# EAGLE design open-bldc (EAGLE 6.2)
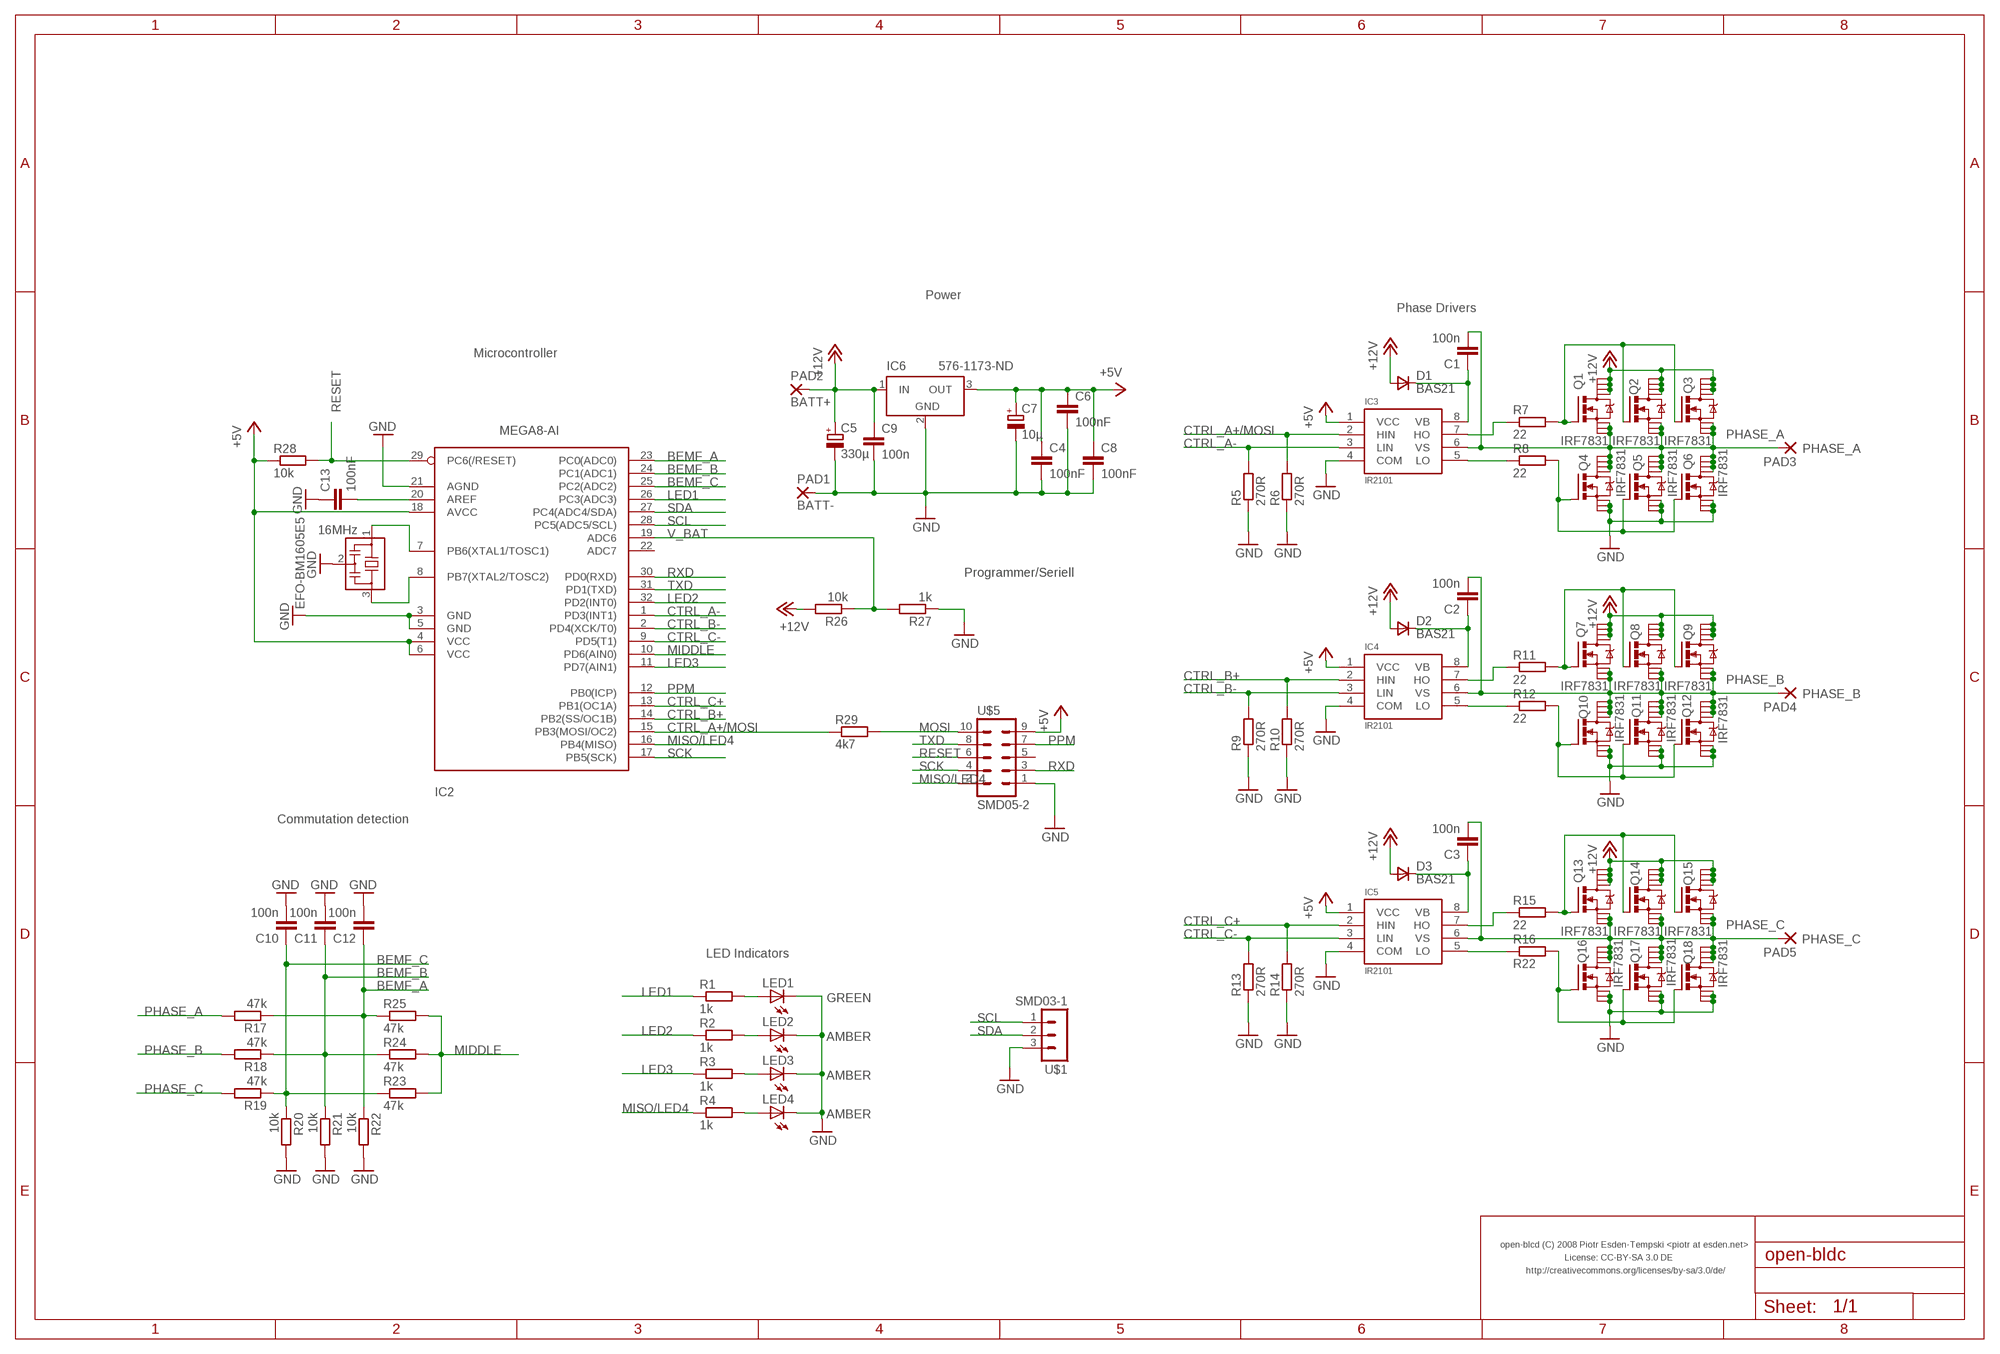
[diagram p0: schematic, sheet 1]

## Parts
C1  100n  C-EUC0603  [C0603]
C2  100n  C-EUC0603  [C0603]
C3  100n  C-EUC0603  [C0603]
C4  100nF  C-EUC0603  [C0603]
C5  330µ  CPOL-EUE3.5-8  [E3,5-8]
C6  100nF  C-EUC0603  [C0603]
C7  10µ  CPOL-EUD/7343-31R  [D/7343-31R]
C8  100nF  C-EUC0603  [C0603]
C9  100n  C-EUC0603  [C0603]
C10  100n  C-EUC0603  [C0603]
C11  100n  C-EUC0603  [C0603]
C12  100n  C-EUC0603  [C0603]
C13  100nF  C-EUC0603  [C0603]
D1  BAS21  VAR2SOT23  [SOT-23]
D2  BAS21  VAR2SOT23  [SOT-23]
D3  BAS21  VAR2SOT23  [SOT-23]
EFO-BM1605E5  16MHz  EFOBM  [EFOBM]
IC2  MEGA8-AI  [TQFP32-08]
IC3  IR2101  [SO-8]
IC4  IR2101  [SO-8]
IC5  IR2101  [SO-8]
IC6  576-1173-ND  LT1129CST5  [SOT223]
LED1  GREEN  LEDCHIP-LED0603  [CHIP-LED0603]
LED2  AMBER  LEDCHIP-LED0603  [CHIP-LED0603]
LED3  AMBER  LEDCHIP-LED0603  [CHIP-LED0603]
LED4  AMBER  LEDCHIP-LED0603  [CHIP-LED0603]
PAD1  BATT-  SMD5  [SMD2,54-5,08]
PAD2  BATT+  SMD5  [SMD2,54-5,08]
PAD3  PHASE_A  SMD5  [SMD2,54-5,08]
PAD4  PHASE_B  SMD5  [SMD2,54-5,08]
PAD5  PHASE_C  SMD5  [SMD2,54-5,08]
Q1  IRF7831  N-MOSFET-SO8S  [SO-08]
Q2  IRF7831  N-MOSFET-SO8S  [SO-08]
Q3  IRF7831  N-MOSFET-SO8S  [SO-08]
Q4  IRF7831  N-MOSFET-SO8S  [SO-08]
Q5  IRF7831  N-MOSFET-SO8S  [SO-08]
Q6  IRF7831  N-MOSFET-SO8S  [SO-08]
Q7  IRF7831  N-MOSFET-SO8S  [SO-08]
Q8  IRF7831  N-MOSFET-SO8S  [SO-08]
Q9  IRF7831  N-MOSFET-SO8S  [SO-08]
Q10  IRF7831  N-MOSFET-SO8S  [SO-08]
Q11  IRF7831  N-MOSFET-SO8S  [SO-08]
Q12  IRF7831  N-MOSFET-SO8S  [SO-08]
Q13  IRF7831  N-MOSFET-SO8S  [SO-08]
Q14  IRF7831  N-MOSFET-SO8S  [SO-08]
Q15  IRF7831  N-MOSFET-SO8S  [SO-08]
Q16  IRF7831  N-MOSFET-SO8S  [SO-08]
Q17  IRF7831  N-MOSFET-SO8S  [SO-08]
Q18  IRF7831  N-MOSFET-SO8S  [SO-08]
R1  1k  R-EU_R0603  [R0603]
R2  1k  R-EU_R0603  [R0603]
R3  1k  R-EU_R0603  [R0603]
R4  1k  R-EU_R0603  [R0603]
R5  270R  R-EU_R0603  [R0603]
R6  270R  R-EU_R0603  [R0603]
R7  22  R-EU_R0603  [R0603]
R8  22  R-EU_R0603  [R0603]
R9  270R  R-EU_R0603  [R0603]
R10  270R  R-EU_R0603  [R0603]
R11  22  R-EU_R0603  [R0603]
R12  22  R-EU_R0603  [R0603]
R13  270R  R-EU_R0603  [R0603]
R14  270R  R-EU_R0603  [R0603]
R15  22  R-EU_R0603  [R0603]
R16  R22  R-EU_R0603  [R0603]
R17  47k  R-EU_R0603  [R0603]
R18  47k  R-EU_R0603  [R0603]
R19  47k  R-EU_R0603  [R0603]
R20  10k  R-EU_R0603  [R0603]
R21  10k  R-EU_R0603  [R0603]
R22  10k  R-EU_R0603  [R0603]
R23  47k  R-EU_R0603  [R0603]
R24  47k  R-EU_R0603  [R0603]
R25  47k  R-EU_R0603  [R0603]
R26  10k  R-EU_R0603  [R0603]
R27  1k  R-EU_R0603  [R0603]
R28  10k  R-EU_R0603  [R0603]
R29  4k7  R-EU_R0603  [R0603]
U$1  SMD03-1  [SMD03-1]
U$5  SMD05-2  [SMD05-2]

## Nets
+5V: C4.1 C6.1 C7.+ C8.1 IC2.4(VCC) IC2.6(VCC) IC2.18(AVCC) IC3.1(VCC) IC4.1(VCC) IC5.1(VCC) IC6.3(OUT) R28.1 U$5.9
+12V: C5.+ C9.1 D1.3(A) D2.3(A) D3.3(A) IC6.1(IN) PAD2.1(P) Q1.5(D) Q1.6(D) Q1.7(D) Q1.8(D) Q2.5(D) Q2.6(D) Q2.7(D) Q2.8(D) Q3.5(D) Q3.6(D) Q3.7(D) Q3.8(D) Q7.5(D) Q7.6(D) Q7.7(D) Q7.8(D) Q8.5(D) Q8.6(D) Q8.7(D) Q8.8(D) Q9.5(D) Q9.6(D) Q9.7(D) Q9.8(D) Q13.5(D) Q13.6(D) Q13.7(D) Q13.8(D) Q14.5(D) Q14.6(D) Q14.7(D) Q14.8(D) Q15.5(D) Q15.6(D) Q15.7(D) Q15.8(D) R26.2
BEMF_A: C12.1 IC2.23(PC0(ADC0)) R17.1 R22.1 R25.1
BEMF_B: C11.1 IC2.24(PC1(ADC1)) R18.1 R21.1 R24.1
BEMF_C: C10.1 IC2.25(PC2(ADC2)) R19.1 R20.1 R23.1
CTRL_A+/MOSI: IC2.15(PB3(MOSI/OC2)) IC3.2(HIN) R6.2 R29.1
CTRL_A-: IC2.1(PD3(INT1)) IC3.3(LIN) R5.2
CTRL_B+: IC2.14(PB2(SS/OC1B)) IC4.2(HIN) R10.2
CTRL_B-: IC2.2(PD4(XCK/T0)) IC4.3(LIN) R9.2
CTRL_C+: IC2.13(PB1(OC1A)) IC5.2(HIN) R14.2
CTRL_C-: IC2.9(PD5(T1)) IC5.3(LIN) R13.2
GND: C4.2 C5.- C6.2 C7.- C8.2 C9.2 C10.2 C11.2 C12.2 C13.1 EFO-BM1605E5.2 IC2.3(GND) IC2.5(GND) IC2.21(AGND) IC3.4(COM) IC4.4(COM) IC5.4(COM) IC6.2(GND) LED1.C LED2.C LED3.C LED4.C PAD1.1(P) Q4.1(S) Q4.2(S) Q4.3(S) Q5.1(S) Q5.2(S) Q5.3(S) Q6.1(S) Q6.2(S) Q6.3(S) Q10.1(S) Q10.2(S) Q10.3(S) Q11.1(S) Q11.2(S) Q11.3(S) Q12.1(S) Q12.2(S) Q12.3(S) Q16.1(S) Q16.2(S) Q16.3(S) Q17.1(S) Q17.2(S) Q17.3(S) Q18.1(S) Q18.2(S) Q18.3(S) R5.1 R6.1 R9.1 R10.1 R13.1 R14.1 R20.2 R21.2 R22.2 R27.1 U$1.3 U$5.1
LED1: IC2.26(PC3(ADC3)) R1.1
LED2: IC2.32(PD2(INT0)) R2.1
LED3: IC2.11(PD7(AIN1)) R3.1
MIDDLE: IC2.10(PD6(AIN0)) R23.2 R24.2 R25.2
MISO/LED4: IC2.16(PB4(MISO)) R4.1 U$5.2
MOSI: R29.2 U$5.10
N$1: IC4.7(HO) R11.1
N$2: IC3.7(HO) R7.1
N$3: LED1.A R1.2
N$4: LED2.A R2.2
N$5: LED3.A R3.2
N$6: C13.2 IC2.20(AREF)
N$7: IC3.5(LO) R8.1
N$8: EFO-BM1605E5.1 IC2.7(PB6(XTAL1/TOSC1))
N$9: EFO-BM1605E5.3 IC2.8(PB7(XTAL2/TOSC2))
N$10: LED4.A R4.2
N$11: Q1.4(G) Q2.4(G) Q3.4(G) R7.2
N$12: C1.1 D1.1(C) IC3.8(VB)
N$13: IC4.5(LO) R12.1
N$14: Q7.4(G) Q8.4(G) Q9.4(G) R11.2
N$15: Q4.4(G) Q5.4(G) Q6.4(G) R8.2
N$16: C2.1 D2.1(C) IC4.8(VB)
N$17: Q10.4(G) Q11.4(G) Q12.4(G) R12.2
N$18: IC5.7(HO) R15.1
N$19: IC5.5(LO) R16.1
N$20: Q13.4(G) Q14.4(G) Q15.4(G) R15.2
N$21: C3.1 D3.1(C) IC5.8(VB)
N$22: Q16.4(G) Q17.4(G) Q18.4(G) R16.2
PHASE_A: C1.2 IC3.6(VS) PAD3.1(P) Q1.1(S) Q1.2(S) Q1.3(S) Q2.1(S) Q2.2(S) Q2.3(S) Q3.1(S) Q3.2(S) Q3.3(S) Q4.5(D) Q4.6(D) Q4.7(D) Q4.8(D) Q5.5(D) Q5.6(D) Q5.7(D) Q5.8(D) Q6.5(D) Q6.6(D) Q6.7(D) Q6.8(D) R17.2
PHASE_B: C2.2 IC4.6(VS) PAD4.1(P) Q7.1(S) Q7.2(S) Q7.3(S) Q8.1(S) Q8.2(S) Q8.3(S) Q9.1(S) Q9.2(S) Q9.3(S) Q10.5(D) Q10.6(D) Q10.7(D) Q10.8(D) Q11.5(D) Q11.6(D) Q11.7(D) Q11.8(D) Q12.5(D) Q12.6(D) Q12.7(D) Q12.8(D) R18.2
PHASE_C: C3.2 IC5.6(VS) PAD5.1(P) Q13.1(S) Q13.2(S) Q13.3(S) Q14.1(S) Q14.2(S) Q14.3(S) Q15.1(S) Q15.2(S) Q15.3(S) Q16.5(D) Q16.6(D) Q16.7(D) Q16.8(D) Q17.5(D) Q17.6(D) Q17.7(D) Q17.8(D) Q18.5(D) Q18.6(D) Q18.7(D) Q18.8(D) R19.2
PPM: IC2.12(PB0(ICP)) U$5.7
RESET: IC2.29(PC6(/RESET)) R28.2 U$5.6
RXD: IC2.30(PD0(RXD)) U$5.3
SCK: IC2.17(PB5(SCK)) U$5.4
SCL: IC2.28(PC5(ADC5/SCL)) U$1.1
SDA: IC2.27(PC4(ADC4/SDA)) U$1.2
TXD: IC2.31(PD1(TXD)) U$5.8
V_BAT: IC2.19(ADC6) R26.1 R27.2
Unconnected: IC2.22(ADC7) U$5.5

## Notes on the sheet
- Power
- Phase Drivers
- Microcontroller
- Programmer/Seriell
- Commutation detection
- LED Indicators
- open-blcd (C) 2008 Piotr Esden-Tempski <piotr at esden.net>
- License: CC-BY-SA 3.0 DE
- http://creativecommons.org/licenses/by-sa/3.0/de/

## Power pins joined to a net without a drawn wire
GND: IC6.4(GND)

## Library data of the parts
C1-C4 C6 C8-C13 = rcl:C-EU: CAPACITOR, European symbol
C5 C7 = rcl:CPOL-EU: POLARIZED CAPACITOR, European symbol
D1-D3 = zetex:VAR2SOT23: DIODE
EFO-BM1605E5 = open-bldc:EFOBM
IC2 = atmel:MEGA8: MICROCONTROLLER 8 Kbytes FLASH, 1 kbytes SRAM, 512 bytes EEPROM, USART, 6-channel 10 bit ADC, 2-channel 8 bit ADC Pin compatible with Atmega48, ATMega88, ATMega168 Source: avr.lbr
IC3-IC5 = open-bldc:IR2101
IC6 = linear-technology:LT1129CST5: VOLTAGE REGULATOR with shutdown
LED1-LED4 = led:LED: LED OSRAM: - CHIPLED LG R971, LG N971, LY N971, LG Q971, LY Q971, LO R971, LY R971 LH N974, LH R974 LS Q976, LO Q976, LY Q976 LO Q996 - Hyper CHIPLED LW Q18S LB Q993, LB Q99A, LB R99A - SideLED LS A670, LO A670, LY A670, LG A670, LP A670 LB A673, LV A673, LT A673, LW A673 LH A674 LY A675 LS A676, LA A676, LO A676, LY A676, LW A676 LS A679, LY A679, LG A679 - Hyper Micro SIDELED® LS Y876, LA Y876, LO Y876, LY Y876 LT Y87S - SmartLED LW L88C, LW L88S LB L89C, LB L89S, LG L890 LS L89K, LO L89K, LY L89K LS L896, LA L896, LO L896, LY L896 - TOPLED LS T670, LO T670, LY T670, LG T670, LP T670 LSG T670, LSP T670, LSY T670, LOP T670, LYG T670 LG T671, LOG T671, LSG T671 LB T673, LV T673, LT T673, LW T673 LH T674 LS T676, LA T676, LO T676, LY T676, LB T676, LH T676, LSB T676, LW T676 LB T67C, LV T67C, LT T67C, LS T67K, LO T67K, LY T67K, LW E67C LS E67B, LA E67B, LO E67B, LY E67B, LB E67C, LV E67C, LT E67C LW T67C LS T679, LY T679, LG T679 LS T770, LO T770, LY T770, LG T770, LP T770 LB T773, LV T773, LT T773, LW T773 LH T774 LS E675, LA E675, LY E675, LS T675 LS T776, LA T776, LO T776, LY T776, LB T776 LHGB T686 LT T68C, LB T68C - Hyper Mini TOPLED® LB M676 - Mini TOPLED Santana® LG M470 LS M47K, LO M47K, LY M47K Source: http://www.osram.convergy.de LUXEON: - LUMILED® LXK2-PW12-R00, LXK2-PW12-S00, LXK2-PW14-U00, LXK2-PW14-V00 LXK2-PM12-R00, LXK2-PM12-S00, LXK2-PM14-U00 LXK2-PE12-Q00, LXK2-PE12-R00, LXK2-PE12-S00, LXK2-PE14-T00, LXK2-PE14-U00 LXK2-PB12-K00, LXK2-PB12-L00, LXK2-PB12-M00, LXK2-PB14-N00, LXK2-PB14-P00, LXK2-PB14-Q00 LXK2-PR12-L00, LXK2-PR12-M00, LXK2-PR14-Q00, LXK2-PR14-R00 LXK2-PD12-Q00, LXK2-PD12-R00, LXK2-PD12-S00 LXK2-PH12-R00, LXK2-PH12-S00 LXK2-PL12-P00, LXK2-PL12-Q00, LXK2-PL12-R00 Source: www.luxeon.com KINGBRIGHT: KA-3528ASYC Source: www.kingbright.com
PAD1-PAD5 = wirepad:SMD5: SMD PAD
Q1-Q18 = my-transistor-power:N-MOSFET-SO8: N-Channel MOSFET Example: FDS7760A; N-Channel Logic Level PowerTrench® MOSFET FDS2572; N-Channel UltraFET® Trench MOSFET Source: www.fairchildsemi.com
R1-R29 = rcl:R-EU_: RESISTOR, European symbol
U$1 = patrick:SMD03-1
U$5 = patrick:SMD05-2

## Net classes
0 default: width 0.152 mm, drill 0.305 mm, clearance 0.152 mm

## Board
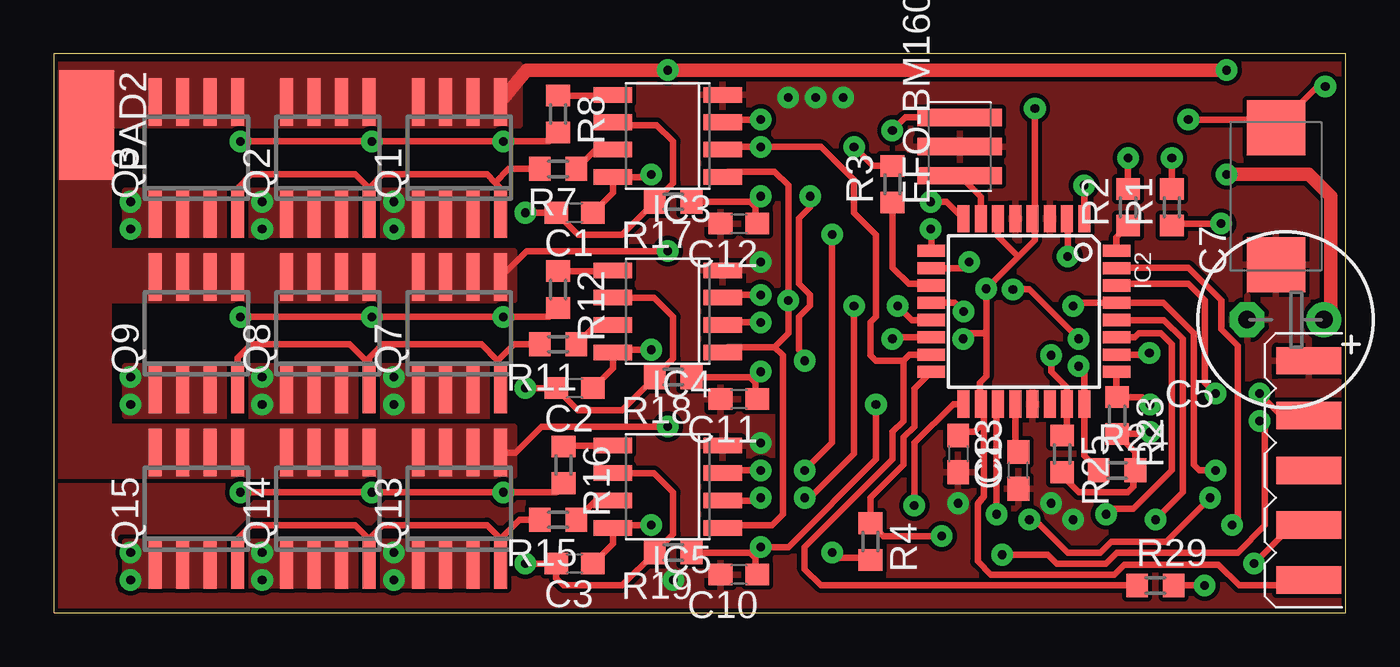
[diagram p1: board, top side]
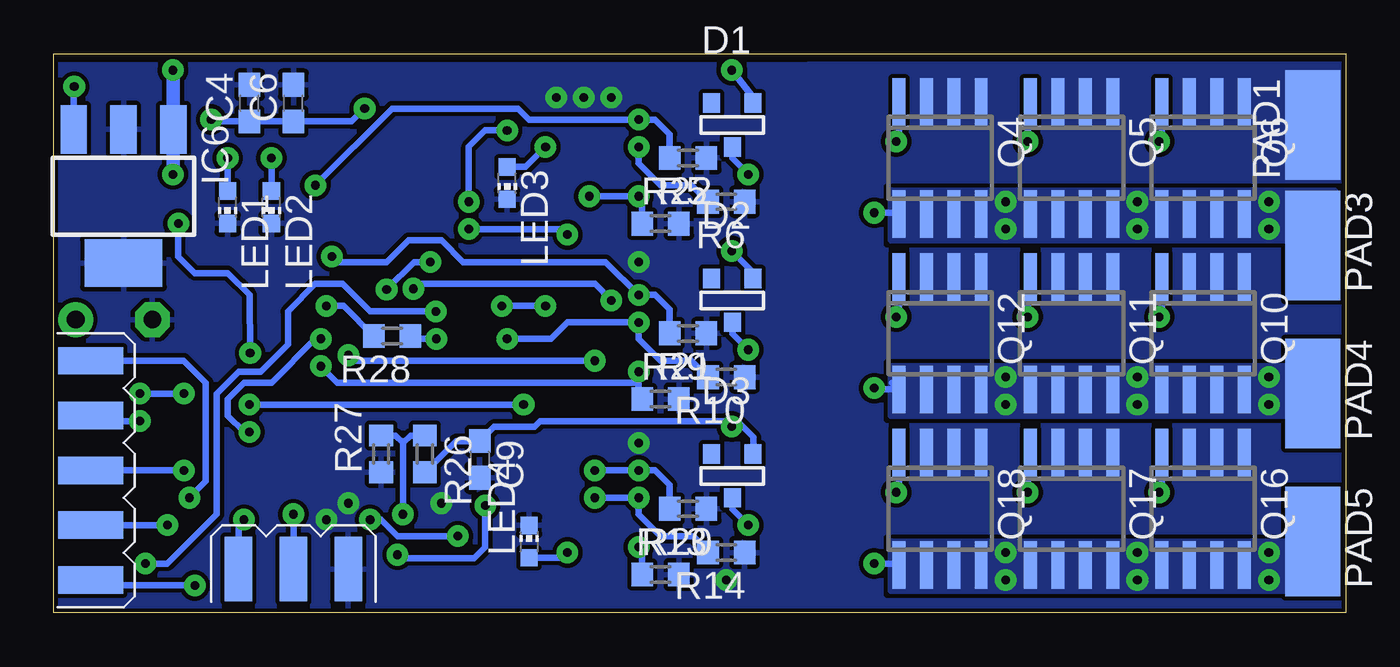
[diagram p2: board, bottom side, seen from below]

Size 59.87 x 25.9 mm. Coordinates in mm from the lower left corner, seen from the top.
Outline: 0,0 0,25.9 59.87,25.9 59.87,0 0.01,0
Copper layers (1*16): Top 0.035mm / dielectric 1.6mm / Bottom 0.035mm
Design rules: minimum track width 0.2mm, minimum drill 0.4mm, track to track 0.2mm, track to pad 0.2mm, pad to pad 0.2mm, via to via 0.2mm, smd to smd 0.2mm, copper to edge 0.2mm, drill to drill 0.2mm, minimum pad ring 0.4mm, minimum via ring 0.3mm, stop-mask expansion 3mil, vias tented up to drill 0mil, thermal gap 8mil

### Footprints (pad centres in the part's own frame; a part is rotated, then mirrored left to right if it is on the bottom)
C0603 = smd 1.1 x 1: 1 -0.85,0; 2 0.85,0
E3,5-8 = drill 0.813 pad 1.6: + -1.778,0 | drill 0.813 pad 1.6 octagon: - 1.778,0
D/7343-31R = smd 2.55 x 2.7: + 3.175,0; - -3.175,0
SOT-23 = smd 0.787 x 0.889: 1 0.025,-1.016; 2 -0.94,1.016; 3 0.991,1.016
EFOBM = smd 0.8 x 3.9: 1 0.7,1.45; 2 2.05,1.45; 3 3.4,1.45
TQFP32-08 = smd 1.27 x 0.559: 1 -4.293,2.8; 2 -4.293,2; 3 -4.293,1.2; 4 -4.293,0.4; 5 -4.293,-0.4; 6 -4.293,-1.2; 7 -4.293,-2; 8 -4.293,-2.8; 17 4.293,-2.8; 18 4.293,-2; 19 4.293,-1.2; 20 4.293,-0.4; 21 4.293,0.4; 22 4.293,1.2; 23 4.293,2; 24 4.293,2.8 | smd 0.559 x 1.27: 9 -2.8,-4.293; 10 -2,-4.293; 11 -1.2,-4.293; 12 -0.4,-4.293; 13 0.4,-4.293; 14 1.2,-4.293; 15 2,-4.293; 16 2.8,-4.293; 25 2.8,4.293; 26 2,4.293; 27 1.2,4.293; 28 0.4,4.293; 29 -0.4,4.293; 30 -1.2,4.293; 31 -2,4.293; 32 -2.8,4.293
SO-8 = smd 0.72 x 1.78: 1 -1.905,-2.543; 2 -0.635,-2.543; 3 0.635,-2.543; 4 1.905,-2.543; 5 1.905,2.543; 6 0.635,2.543; 7 -0.635,2.543; 8 -1.905,2.543
SOT223 = smd 1.219 x 2.235: 1 -2.311,-3.099; 2 0,-3.099; 3 2.311,-3.099 | smd 3.6 x 2.2: 4 0,3.099
CHIP-LED0603 = smd 0.8 x 0.8: A 0,-0.75; C 0,0.75
SMD2,54-5,08 = smd 2.54 x 5.08: 1 0,0
SO-08 = smd 0.6 x 2.2: 1 -1.905,-2.6; 2 -0.635,-2.6; 3 0.635,-2.6; 4 1.905,-2.6; 5 1.905,2.6; 6 0.635,2.6; 7 -0.635,2.6; 8 -1.905,2.6
R0603 = smd 1 x 1.1: 1 -0.85,0; 2 0.85,0
SMD03-1 = smd 1.27 x 3: 1 1.27,1.524; 2 3.81,1.524; 3 6.35,1.524
SMD05-2 = smd 1.27 x 3 bottom: 1 1.27,1.524; 3 3.81,1.524; 5 6.35,1.524; 7 8.89,1.524; 9 11.43,1.524 | smd 1.27 x 3: 2 1.27,1.524; 4 3.81,1.524; 6 6.35,1.524; 8 8.89,1.524; 10 11.43,1.524

### Placement (x,y rotation side)
C1  24.13,18.54 180 top
C2  24.13,10.41 180 top
C3  24.13,2.29 180 top
C4  50.8,23.62 90 bottom
C5  57.08,13.59 180 top
C6  48.77,23.62 90 bottom
C7  56.64,19.3 90 top
C8  41.91,7.37 270 top
C9  40.13,7.11 270 bottom
C10  31.75,1.78 180 top
C11  31.75,9.91 180 top
C12  31.75,18.03 180 top
C13  44.7,6.6 90 top
D1  28.45,22.61 0 bottom
D2  28.45,14.48 0 bottom
D3  28.45,6.35 0 bottom
EFO-BM1605E5  43.43,19.56 90 top
IC2  44.96,13.97 270 top
IC3  28.45,22.1 90 top
IC4  28.45,13.97 90 top
IC5  28.45,5.84 90 top
IC6  56.64,19.3 180 bottom
LED1  51.82,18.8 180 bottom
LED2  49.78,18.8 180 bottom
LED3  38.86,19.91 180 bottom
LED4  37.85,3.3 0 bottom
PAD1  1.52,22.61 0 bottom
PAD2  1.52,22.61 180 top
PAD3  1.52,17.02 180 bottom
PAD4  1.52,10.16 180 bottom
PAD5  1.52,3.3 180 bottom
Q1  18.8,21.08 0 top
Q2  12.7,21.08 0 top
Q3  6.6,21.08 0 top
Q4  18.8,21.08 180 bottom
Q5  12.7,21.08 180 bottom
Q6  6.6,21.08 180 bottom
Q7  18.8,12.95 0 top
Q8  12.7,12.95 0 top
Q9  6.6,12.95 0 top
Q10  6.6,12.95 180 bottom
Q11  12.7,12.95 180 bottom
Q12  18.8,12.95 180 bottom
Q13  18.8,4.83 0 top
Q14  12.7,4.83 0 top
Q15  6.6,4.83 0 top
Q16  6.6,4.83 180 bottom
Q17  12.7,4.83 180 bottom
Q18  18.8,4.83 180 bottom
R1  51.82,18.8 90 top
R2  49.78,18.8 90 top
R3  38.86,19.86 90 top
R4  37.85,3.3 270 top
R5  30.48,21.08 180 bottom
R6  28.7,19.05 180 bottom
R7  23.37,20.57 180 top
R8  23.37,23.11 270 top
R9  30.48,12.95 180 bottom
R10  28.7,10.92 180 bottom
R11  23.37,12.45 180 top
R12  23.37,14.99 270 top
R13  30.48,4.83 180 bottom
R14  28.7,2.79 180 bottom
R15  23.37,4.32 180 top
R16  23.62,6.86 270 top
R17  28.7,19.05 180 top
R18  28.7,10.92 180 top
R19  28.7,2.79 180 top
R20  31.75,1.78 0 bottom
R21  31.75,9.91 0 bottom
R22  31.75,18.03 0 bottom
R23  49.28,9.14 270 top
R24  49.28,6.6 0 top
R25  46.74,7.37 270 top
R26  42.67,7.37 270 bottom
R27  44.7,7.37 90 bottom
R28  44.2,12.83 180 bottom
R29  51.05,1.27 0 top
U$1  52.58,0.51 0 bottom
U$5  59.69,12.95 270 bottom

### Tracks (layer width: path | path; a pad name or v marks a point on that pad's centre or on a via)
+5V  (via drill 0.4)
  Top 0.305: 31.12,12.19 IC4.1 31.25,12.32 33.4,12.32 | 33.4,12.32 33.78,11.94 33.78,4.57 33.27,4.06 31.12,4.06 IC5.1 | IC3.1 31.25,20.45 33.4,20.45 34.04,19.81 v34.04,14.48 34.04,12.95 33.4,12.32 | IC2.6 43.76,17.46 44.7,16.51 | 44.7,16.51 45.47,17.27 45.47,18.16 IC2.4 45.47,18.37 v45.47,23.37 | 44.7,16.51 v43.21,15.02 43.21,12.95 | 43.21,12.95 43.21,10.95 42.93,10.67 42.93,9.71 IC2.18 43.1,9.53 | v58.93,24.38 58.55,24.38 C7.+ 56.26,22.86 v52.58,22.86 | 43.1,9.53 43.1,5.41 42.82,5.05 42.82,2.39 43.43,1.78 49.15,1.78 49.61,2.23 53.98,2.23 54.94,1.27 57.91,1.27 U$5.9 58.06,1.17 | 43.1,9.53 43.1,8.81 42.67,8.38 42.08,8.38 C8.1 | v42.14,12.7 42.42,12.95 43.21,12.95
  Bottom 0.305: v43.21,15.02 42.99,15.24 34.8,15.24 v34.04,14.48 | IC6.3 58.95,24.36 v58.93,24.38 | C4.1 50.97,22.61 | C4.1 C6.1 46.06,22.77 v45.47,23.37 | v52.58,22.86 52.49,22.77 C4.1 | R28.1 43.22,12.7 v42.14,12.7
+12V  (via drill 0.4)
  Top 0.305: Q13.5 21.4,7.43 22.61,8.64 v28.45,8.64 | v28.45,16.76 21.91,16.76 Q7.5
  Top 0.635: Q1.5 21.91,25.15 v28.45,25.15 v54.36,25.15 | v54.36,20.32 58.17,20.32 59.18,19.3 59.18,13.78 C5.+
  Bottom 0.305: D3.3 27.43,7.39 27.43,8.13 28.19,8.89 v28.45,8.64 28.7,8.89 37.34,8.89 37.59,8.64 39.46,8.64 C9.1 41.23,7.96 R26.2 | D2.3 27.46,15.77 v28.45,16.76 | D1.3 27.46,23.9 v28.45,25.15
  Bottom 0.635: IC6.1 54.33,23.39 | v54.36,25.15 54.33,25.12 IC6.1 | IC6.1 54.33,20.34 v54.36,20.32
  pour Top (no thermals): 21.34,6.35 0,6.35 0,25.4 21.59,25.4 21.59,22.61 2.54,22.61 2.54,16.76 21.34,16.76 21.34,14.48 2.54,14.48 2.54,8.64 21.34,8.64
BEMF_A  (via drill 0.4)
  Top 0.305: R17.1 32.26,19.05 32.38,18.92 | 32.38,18.92 32.51,18.8 32.51,18.12 C12.1 | v32.77,19.3 32.38,18.92 | R25.1 46.96,8.44 IC2.23 46.96,10.45 46.23,11.18 v46.23,11.94 | v35.05,19.3 35.05,18.8 34.54,18.29 34.54,15.24 35.05,14.73 35.05,14.22 34.54,13.72 34.54,12.19 v34.8,11.68
  Bottom 0.305: C12.1 32.6,19.14 v32.77,19.3 v35.05,19.3 | v46.23,11.94 45.97,11.68 v34.8,11.68
BEMF_B  (via drill 0.4)
  Top 0.305: R18.1 32.26,10.92 32.38,10.79 | 32.38,10.79 32.51,10.67 32.51,9.99 C11.1 | 32.38,10.79 v32.77,11.18 | R24.1 47.76,7.27 IC2.24 47.76,11.17 v47.5,11.43
  Bottom 0.305: C11.1 32.77,10.07 32.77,10.67 | v32.77,11.18 32.77,10.67 | v47.5,11.43 46.74,10.67 32.77,10.67
BEMF_C  (via drill 0.4)
  Top 0.305: R19.1 32.26,2.79 32.38,2.67 | 32.38,2.67 32.51,2.54 32.51,1.87 C10.1 | 32.38,2.67 v32.77,3.05 34.04,3.05 38.1,7.11 v38.1,9.65 | IC2.25 49.25,10.02 R23.1 50.46,9.99 v50.8,9.65
  Bottom 0.305: C10.1 32.6,2.88 v32.77,3.05 | v38.1,9.65 v50.8,9.65
CTRL_A+/MOSI  (via drill 0.4)
  Top 0.305: IC3.2 arc-90 31.12,21.59 v32.77,21.59 35.56,21.59 37.08,20.07 37.08,18.54 38.1,17.53 38.1,13.72 37.85,13.46 37.85,11.94 38.1,11.68 39.37,11.68 | IC2.15 39.66,11.97 39.37,11.68 | 39.37,11.68 39.37,8.89 38.86,8.38 38.86,7.11 34.8,3.05 34.8,2.03 35.56,1.27 R29.1
  Bottom 0.305: R6.2 30.31,19.81 31.75,19.81 32.77,20.83 v32.77,21.59
CTRL_A-  (via drill 0.4)
  Top 0.305: v32.77,22.86 31.12,22.86 IC3.3 | v47.75,19.81 IC2.1
  Bottom 0.305: R5.2 31.33,22.19 32,22.86 v32.77,22.86 37.85,22.86 38.35,23.37 44.2,23.37 v47.75,19.81
CTRL_B+  (via drill 0.4)
  Top 0.305: v32.77,13.46 31.12,13.46 IC4.2 | v38.86,12.7 39.05,12.77 IC2.14
  Bottom 0.305: R10.2 30.31,11.68 31.75,11.68 32.77,12.7 v32.77,13.46 36.07,13.46 36.83,12.7 v38.86,12.7
CTRL_B-  (via drill 0.4)
  Top 0.305: v32.77,14.73 31.12,14.73 IC4.3 | v46.99,16.51 46.99,18.23 IC2.2
  Bottom 0.305: R9.2 31.33,14.06 32,14.73 v32.77,14.73 34.29,16.26 40.89,16.26 41.91,17.27 43.43,17.27 44.45,16.26 46.74,16.26 v46.99,16.51
CTRL_C+  (via drill 0.4)
  Top 0.305: v32.77,5.33 32.64,5.21 IC5.2 | v34.8,5.33 35.05,5.33 37.08,7.37 v37.08,14.22 | IC2.13 39.77,13.57 v39.12,14.22
  Bottom 0.305: R14.2 29.55,2.88 30.23,3.56 31.75,3.56 32.77,4.57 v32.77,5.33 v34.8,5.33 | v37.08,14.22 v39.12,14.22
CTRL_C-  (via drill 0.4)
  Top 0.305: v32.77,6.6 31.12,6.6 IC5.3 | v34.8,6.6 36.07,7.87 v36.07,17.53 | v40.64,17.78 40.66,18.01 IC2.9
  Bottom 0.305: R13.2 31.33,5.93 32,6.6 v32.77,6.6 v34.8,6.6 | v36.07,17.53 36.32,17.78 v40.64,17.78
GND  (via drill 0.4)
  other vias: 28.7,1.52 32.77,7.87 32.77,16.26 41.91,5.08 34.04,23.88 35.31,23.88 36.58,23.88 46.23,5.08 47.24,4.32
  pour Bottom (rank 3): 0,0 0,25.4 59.69,25.4 59.69,0
  pour Top (rank 3): 0,25.4 59.69,25.4 59.69,0 0,0
  pour Bottom (rank 2, no thermals): 0,25.4 24.89,25.4 25.65,-0.25 0,0
LED1  (via drill 0.4)
  Top 0.305: v54.1,18.03 51.9,18.03 R1.1 | IC2.26 50.77,11.97 v50.77,12.04
  Bottom 0.305: v54.1,18.03 54.1,16.51 53.34,15.75 51.82,15.75 50.8,14.73 v50.77,12.04
LED2
  Top 0.305: R2.1 49.25,17.41 IC2.32
LED3
  Top 0.305: R3.1 38.86,16 39.62,15.24 40.59,15.24 IC2.11
MIDDLE  (via drill 0.4)
  Top 0.305: R23.2 50.13,7.44 R24.2 50.04,6.52 50.04,5.84 49.78,5.59 47.5,5.59 46.74,6.35 R25.2 | IC2.10 42.13,15.97 v42.42,16.26 | v44.45,14.99 45.21,14.99 v47.5,12.7 | R23.2 49.36,8.38 | v50.8,8.38 50.71,8.29 R23.2
  Bottom 0.305: v42.42,16.26 43.18,16.26 v44.45,14.99 | v47.5,12.7 47.75,12.7 49.78,10.67 51.05,10.67 51.82,9.91 51.82,9.14 51.05,8.38 v50.8,8.38
MISO/LED4  (via drill 0.4)
  Top 0.305: IC2.16 39.88,10.38 39.88,8.64 39.37,8.13 39.37,6.86 37.85,5.33 R4.1 38.44,3.56 v41.15,3.56 | v45.21,4.32 45.47,4.32 46.99,2.79 48.51,2.79 49.02,3.3 51.56,3.3 v53.59,5.33
  Bottom 0.305: v53.59,5.33 52.83,6.1 52.83,10.67 53.85,11.68 U$5.2 | v41.15,3.56 43.94,3.56 44.7,4.32 v45.21,4.32
MOSI  (via drill 0.4)
  Top 0.305: R29.2 v53.34,1.27
  Bottom 0.305: v53.34,1.27 57.91,1.27 U$5.10
N$1
  Top 0.305: R11.1 25.11,13.34 IC4.7
N$2
  Top 0.305: R7.1 25.11,21.46 IC3.7
N$3  (via drill 0.4)
  Top 0.305: v51.82,21.08 R1.2
  Bottom 0.305: LED1.A v51.82,21.08
N$4  (via drill 0.4)
  Top 0.305: v49.78,21.08 R2.2
  Bottom 0.305: LED2.A v49.78,21.08
N$5  (via drill 0.4)
  Top 0.305: v37.08,21.59 37.96,20.71 R3.2
  Bottom 0.305: LED3.A 38.01,20.66 v37.08,21.59
N$6
  Top 0.305: C13.2 44.56,7.6 IC2.20
N$7
  Top 0.305: R8.1 25.87,23.96 IC3.5
N$8
  Top 0.305: EFO-BM1605E5.1 42.96,19.28 IC2.7
N$9  (via drill 0.4)
  Top 0.305: EFO-BM1605E5.3 39.47,22.96 v38.86,22.35 | v40.64,19.05 41.37,19.05 IC2.8
  Bottom 0.305: v38.86,22.35 39.88,22.35 40.64,21.59 v40.64,19.05
N$10  (via drill 0.4)
  Top 0.305: R4.2 LED4.A 36.31,2.55 v36.07,2.79
  Bottom 0.305: v36.07,2.79 36.31,2.55 LED4.A
N$11
  Top 0.305: Q3.4 8.51,19.68 9.14,20.32 13.97,20.32 14.48,19.81 14.48,18.61 Q2.4 14.61,19.68 15.24,20.32 20.07,20.32 20.45,19.94 | 20.45,19.94 20.83,19.56 20.83,18.61 Q1.4 | R7.2 21.08,20.57 20.45,19.94
N$12  (via drill 0.4)
  Top 0.305: C1.1 25.91,19.47 IC3.8 27.56,20.19 v27.69,20.32
  Bottom 0.305: v27.69,20.32 28.42,21.06 D1.1
N$13
  Top 0.305: R12.1 25.87,15.84 IC4.5
N$14
  Top 0.305: Q9.4 8.51,11.81 9.14,12.45 13.72,12.45 14.48,11.68 14.48,10.48 Q8.4 14.61,11.81 15.24,12.45 19.81,12.45 20.57,11.68 | 20.57,11.68 20.57,10.48 Q7.4 | R11.2 21.34,12.45 20.57,11.68
N$15  (via drill 0.4)
  Top 0.305: v8.64,21.84 v14.73,21.84 v20.83,21.84 22.95,21.84 R8.2
  Bottom 0.305: Q6.4 8.51,21.97 v8.64,21.84 | v14.73,21.84 14.73,23.55 Q5.4 | Q4.4 20.7,21.97 v20.83,21.84
N$16  (via drill 0.4)
  Top 0.305: C2.1 25.91,11.34 IC4.8 26.03,12.19 v27.69,12.19
  Bottom 0.305: D2.1 28.42,12.93 v27.69,12.19
N$17  (via drill 0.4)
  Top 0.305: v8.64,13.72 v14.73,13.72 v20.83,13.72 22.95,13.72 R12.2
  Bottom 0.305: Q10.4 8.51,13.84 v8.64,13.72 | v14.73,13.72 14.73,15.43 Q11.4 | Q12.4 20.7,13.84 v20.83,13.72
N$18
  Top 0.305: 25.78,5.33 IC5.7 25.11,5.21 R15.1
N$19
  Top 0.305: 25.87,7.71 IC5.5 23.66,7.75 R16.1
N$20
  Top 0.305: Q15.4 8.51,3.43 9.14,4.06 13.97,4.06 14.73,3.3 14.73,2.35 Q14.4 14.61,3.43 15.24,4.06 20.07,4.06 20.7,3.43 | 20.7,3.43 20.83,3.3 20.83,2.35 Q13.4 | 20.7,3.43 21.59,4.32 R15.2
N$21  (via drill 0.4)
  Top 0.305: v27.69,4.06 26.03,4.06 IC5.8 25.91,3.21 C3.1
  Bottom 0.305: D3.1 28.42,5.31 | D3.1 28.42,5.05 | v27.69,4.06 28.42,4.8 D3.1
N$22  (via drill 0.4)
  Top 0.305: v8.64,5.59 v14.73,5.59 v20.83,5.59 23.2,5.59 arc90 R16.2
  Bottom 0.305: Q16.4 8.51,5.71 v8.64,5.59 | v14.73,5.59 14.73,7.3 Q17.4 | Q18.4 20.7,5.71 v20.83,5.59
PHASE_A  (via drill 0.4)
  Top 0.305: v21.84,18.54 C1.2 24.3,17.53 26.33,17.53 R17.2 28.7,19.9 28.7,21.84 27.94,22.61 26.03,22.61 IC3.6
  Bottom 0.305: v21.84,18.54 20.76,18.54 Q4.5
  other vias: 9.65,19.05 9.65,17.78 15.75,17.78 15.75,19.05 3.56,19.05 3.56,17.78
  pour Bottom (no thermals): 0.51,19.56 21.08,19.56 21.08,17.27 0.51,17.27
  pour Top (no thermals): 3.3,19.56 21.08,19.56 21.08,17.53 3.3,17.53
PHASE_B  (via drill 0.4)
  Top 0.305: v21.84,10.41 C2.2 24.3,9.4 26.33,9.4 R18.2 28.7,11.77 28.7,13.72 27.81,14.61 IC4.6
  Bottom 0.305: 21.02,10.67 Q12.5 21.84,10.35 v21.84,10.41
  other vias: 9.65,10.92 9.65,9.65 15.75,10.92 15.75,9.65 3.56,10.92 3.56,9.65
  pour Bottom (no thermals): 0.51,11.43 21.08,11.43 21.08,9.14 0.51,9.14
  pour Top (no thermals): 3.3,11.43 20.83,11.43 20.83,9.14 3.3,9.14
PHASE_C  (via drill 0.4)
  Top 0.305: v21.84,2.29 C3.2 23.28,1.61 23.62,1.27 26.33,1.27 R19.2 28.7,3.64 28.7,5.59 27.81,6.48 26.67,6.48 | 26.67,6.48 IC5.6 | 26.67,6.48 26.8,6.48
  Bottom 0.305: Q18.5 20.76,2.29 v21.84,2.29
  other vias: 9.65,2.79 9.65,1.52 15.75,2.79 15.75,1.52 3.56,2.79 3.56,1.52
  pour Bottom (no thermals): 0.51,3.3 21.08,3.3 21.08,1.02 0.51,1.02
  pour Top (no thermals): 3.3,3.3 21.08,3.3 21.08,1.27 3.3,1.27
PPM  (via drill 0.4)
  Top 0.305: IC2.12 41.76,14.37 v42.16,13.97 | v55.63,2.29 57.15,3.81 U$5.7
  Bottom 0.305: v55.63,2.29 54.61,2.29 52.32,4.57 52.32,10.16 51.31,11.18 50.29,11.18 49.02,12.45 49.02,13.97 47.75,15.24 46.48,15.24 45.21,13.97 v42.16,13.97
RESET  (via drill 0.4)
  Top 0.305: v53.85,6.6 53.09,6.6 52.83,6.86 52.83,12.95 51.42,14.37 IC2.29 47.39,14.37 v47.24,14.22
  Bottom 0.305: v53.85,6.6 U$5.6 | R28.2 46.44,14.22 v47.24,14.22
RXD  (via drill 0.4)
  Top 0.305: IC2.30 49.32,15.24 52.58,15.24 53.34,14.48 53.34,10.67 v53.85,10.16 | v55.88,10.16 56.9,9.14 U$5.3
  Bottom 0.305: v53.85,10.16 v55.88,10.16
SCK  (via drill 0.4)
  Top 0.305: IC2.17 41.68,9.68 39.88,7.87 v39.88,4.98 | v43.94,2.69 46.08,2.69 46.48,2.29 48.77,2.29 49.28,2.79 54.86,2.79 56.13,4.06 56.13,8.64 v55.88,8.89
  Bottom 0.305: v39.88,4.98 39.88,3.05 40.39,2.54 43.79,2.54 v43.94,2.69 | v55.88,8.89 57.91,8.89 U$5.4
SCL  (via drill 0.4)
  Top 0.305: IC2.28 51.45,13.57 52.32,12.7 52.32,5.59 v51.05,4.32
  Bottom 0.305: v51.05,4.32 51.31,4.06 U$1.1
SDA  (via drill 0.4)
  Top 0.305: IC2.27 50.11,12.77 50.29,12.95 51.31,12.95 51.82,12.45 51.82,6.6 50.04,4.83 49.02,4.83 v48.77,4.57
  Bottom 0.305: 48.77,2.79 U$1.2 v48.77,4.57
TXD  (via drill 0.4)
  Top 0.305: IC2.31 49.28,16 52.58,16 54.1,14.48 54.1,13.13 54.86,12.37 54.86,4.32 v54.61,4.06
  Bottom 0.305: v54.61,4.06 U$5.8
V_BAT  (via drill 0.4)
  Top 0.305: v43.69,4.57 43.69,9.61 IC2.19
  Bottom 0.305: R27.2 44.03,8.22 43.69,7.87 | v43.69,4.57 43.69,7.87 | R26.1 43.35,8.22 43.69,7.87

### Text on the board
tStop: Open-BLDC | V0.1
bStop: Open-BLDC | V0.1
Reference: open-bldc (C) 2008 Piotr Esden-Tempski <piotr at esden dot net> | License: CC-BY-SA 3.0 DE | http://creativecommons.org/licenses/by-sa/3.0/de